# EAGLE design BASIS-LocoNet-1.1 (EAGLE 7.7.0)
LocoNet Arduino Basisboard für piggyback PCBs
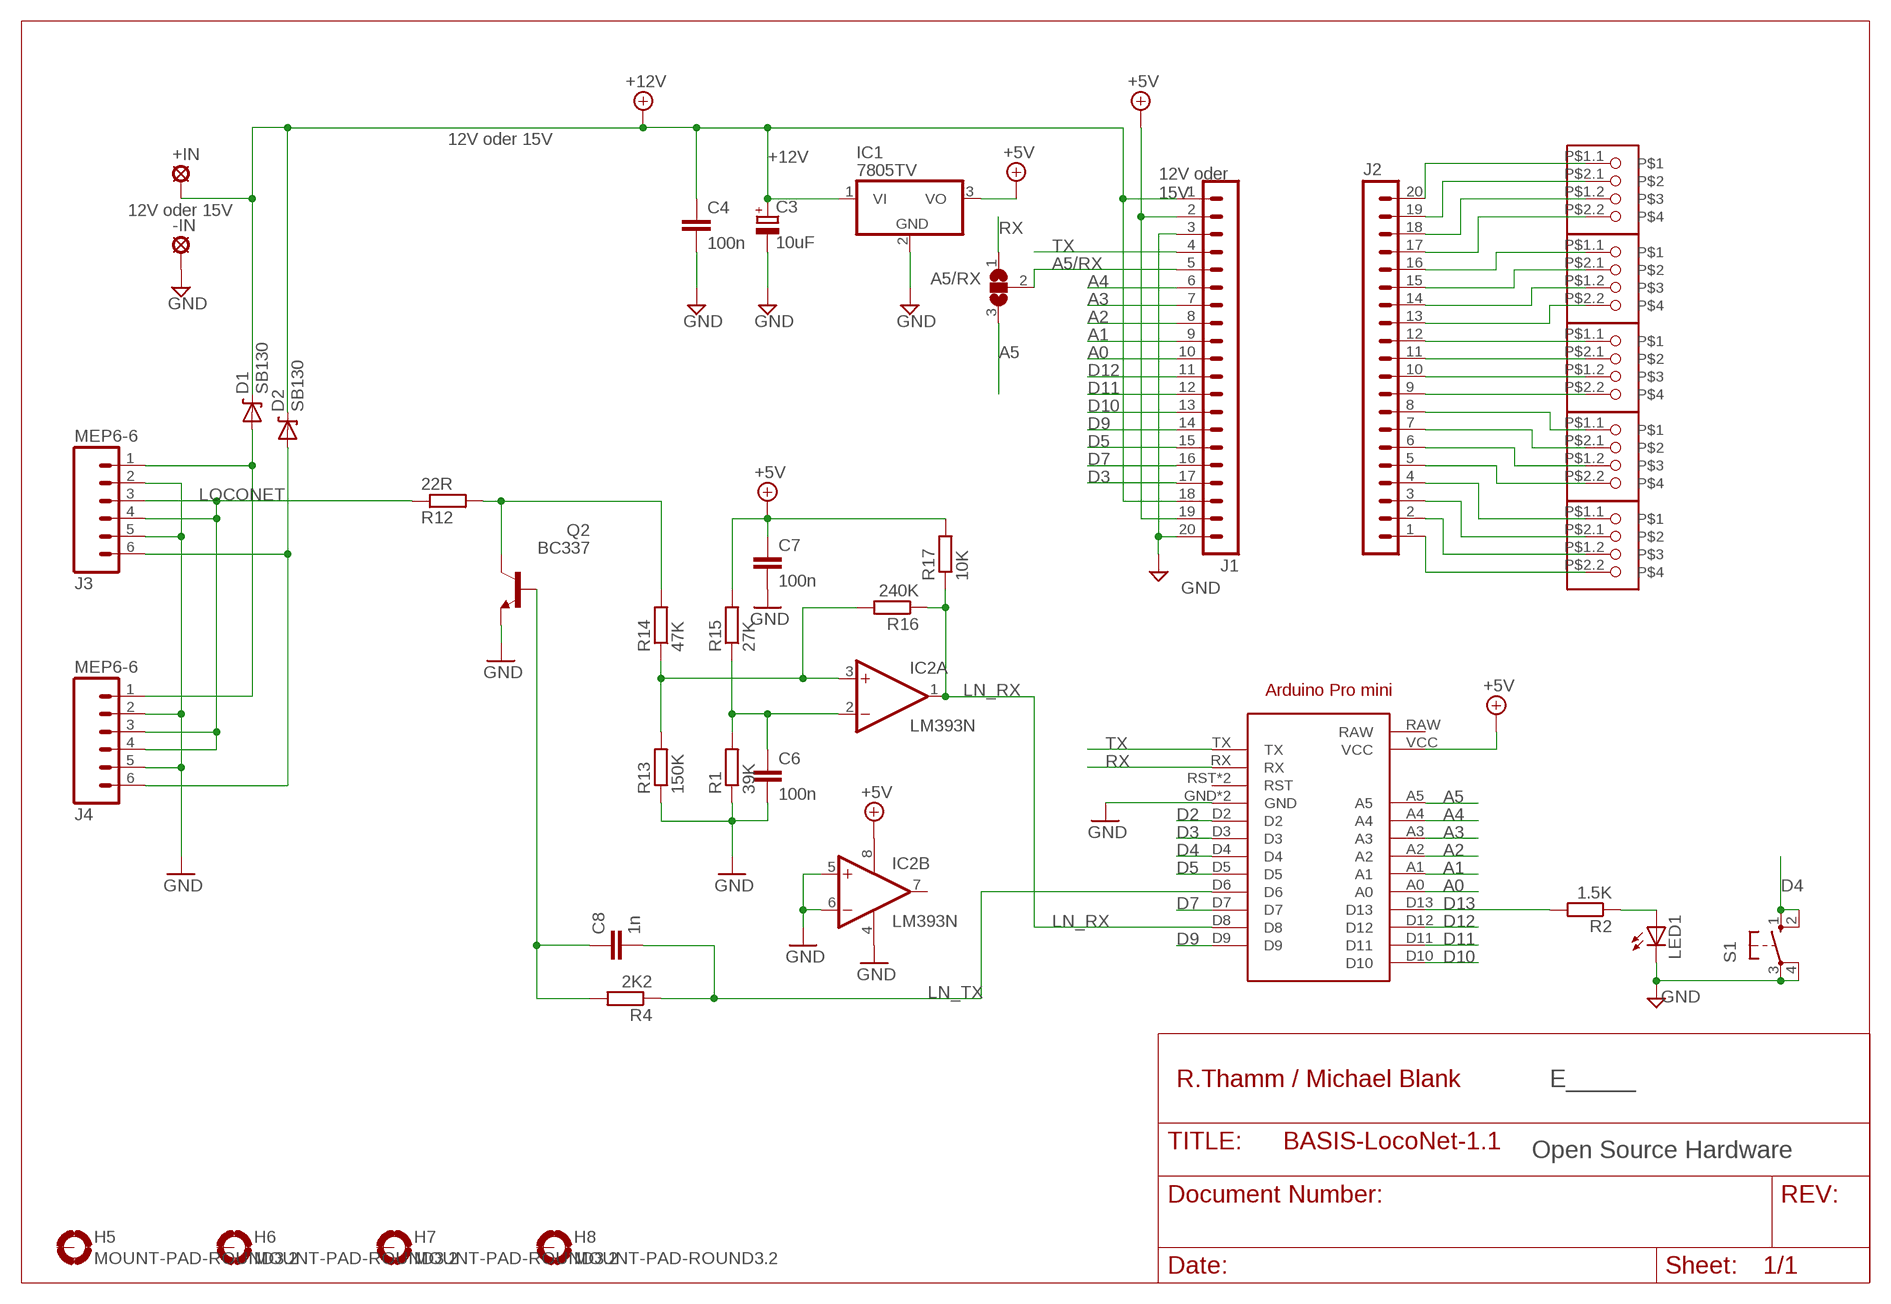
[diagram p0: schematic, sheet 1]

## Parts
+IN  LSP13  [LSP13]
-IN  LSP13  [LSP13]
A5/RX  SJ2W  [SJ_2]
ARDUINO2  ArduinoProMini_5V  ARDUINO_PRO_MINI  [ARDUINO_PRO_MINI]
C3  10uF  CPOL-EUE2.5-7  [E2,5-7]
C4  100n  C-EU050-025X075  [C050-025X075]
C6  100n  C-EU025-025X050  [C025-025X050]
C7  100n  C-EU025-025X050  [C025-025X050]
C8  1n  C-EU025-025X050  [C025-025X050]
D1  SB130  DIODE-ZENERPTH  [DIODE-ZENER]
D2  SB130  DIODE-ZENERPTH  [DIODE-ZENER]
H5  MOUNT-PAD-ROUND3.2  [3,2-PAD]
H6  MOUNT-PAD-ROUND3.2  [3,2-PAD]
H7  MOUNT-PAD-ROUND3.2  [3,2-PAD]
H8  MOUNT-PAD-ROUND3.2  [3,2-PAD]
IC1  7805TV  [TO220V]
IC2  LM393N  [DIL08]
J1  MA20-1  [MA20-1]
J2  MA20-1  [MA20-1]
J3  MEP6-6  RJ11-6PTH  [RJ11-6]
J4  MEP6-6  RJ11-6PTH  [RJ11-6]
LED1  LED3MM  [LED3MM]
Q2  BC337  [TO92]
R1  39K  R-EU_0207/10  [0207/10]
R2  1.5K  R-EU_0207/10  [0207/10]
R4  2K2  R-EU_0207/10  [0207/10]
R12  22R  R-EU_0207/10  [0207/10]
R13  150K  R-EU_0207/10  [0207/10]
R14  47K  R-EU_0207/10  [0207/10]
R15  27K  R-EU_0207/10  [0207/10]
R16  240K  R-EU_0207/10  [0207/10]
R17  10K  R-EU_0207/10  [0207/10]
S1  10-XX  [B3F-10XX]
U$1  AKL093-06  [AKL093-06]
U$2  AKL093-06  [AKL093-06]
U$3  AKL093-06  [AKL093-06]
U$4  AKL093-06  [AKL093-06]
U$5  AKL093-06  [AKL093-06]

## Nets
+5V: ARDUINO2.VCC C7.1 IC1.3(VO) IC2.8(P:V+) J1.2 J1.19 R15.2 R17.2
+12V: +IN.MP C3.+ C4.1 D1.P$1(C) D2.P$1(C) IC1.1(VI) J1.1 J1.18
A0: ARDUINO2.A0 J1.10
A1: ARDUINO2.A1 J1.9
A2: ARDUINO2.A2 J1.8
A3: ARDUINO2.A3 J1.7
A4: ARDUINO2.A4 J1.6
A5: A5/RX.3 ARDUINO2.A5
A5/RX: A5/RX.2 J1.5
D2: ARDUINO2.D2
D3: ARDUINO2.D3 J1.17
D4: ARDUINO2.D4 S1.1(S) S1.2(S1)
D5: ARDUINO2.D5 J1.15
D7: ARDUINO2.D7 J1.16
D9: ARDUINO2.D9 J1.14
D10: ARDUINO2.D10 J1.13
D11: ARDUINO2.D11 J1.12
D12: ARDUINO2.D12 J1.11
D13: ARDUINO2.D13 R2.2
GND: -IN.MP ARDUINO2.GND ARDUINO2.GND@1(GND) C3.- C4.2 C6.2 C7.2 IC1.2(GND) IC2.4(P:V-) IC2.5(B:+IN) IC2.6(B:-IN) J1.3 J1.20 J3.2 J3.5 J4.2 J4.5 LED1.K(C) Q2.1(E) R1.1 R13.1 S1.3(P) S1.4(P1)
LN_RX: ARDUINO2.D8 IC2.1(A:OUT) R16.1 R17.1
LN_TX: ARDUINO2.D6 C8.2 R4.1
LOCONET: J3.3 J3.4 J4.3 J4.4 R12.1
N$1: LED1.A R2.1
N$6: J2.1 U$4.P$2.2
N$8: J2.2 U$4.P$1.2
N$9: J2.3 U$4.P$2.1
N$10: J2.4 U$4.P$1.1
N$11: J2.5 U$3.P$2.2
N$12: J2.6 U$3.P$1.2
N$13: J2.7 U$3.P$2.1
N$14: J2.8 U$3.P$1.1
N$15: J2.9 U$1.P$2.2
N$16: J2.10 U$1.P$1.2
N$17: J2.11 U$1.P$2.1
N$18: J2.12 U$1.P$1.1
N$19: J2.13 U$2.P$2.2
N$20: J2.14 U$2.P$1.2
N$21: J2.15 U$2.P$2.1
N$22: J2.16 U$2.P$1.1
N$23: J2.17 U$5.P$2.2
N$24: J2.18 U$5.P$1.2
N$25: J2.19 U$5.P$2.1
N$26: J2.20 U$5.P$1.1
N$28: D1.P$2(A) J3.1 J4.1
N$29: C6.1 IC2.2(A:-IN) R1.2 R15.1
N$30: C8.1 Q2.2(B) R4.2
N$32: IC2.3(A:+IN) R13.2 R14.1 R16.2
N$36: Q2.3(C) R12.2 R14.2
N$37: D2.P$2(A) J3.6 J4.6
RX: A5/RX.1 ARDUINO2.RX
TX: ARDUINO2.TX J1.4
Unconnected: ARDUINO2.RAW ARDUINO2.RST ARDUINO2.RST@1(RST) H5.B3,2(MOUNT) H6.B3,2(MOUNT) H7.B3,2(MOUNT) H8.B3,2(MOUNT) IC2.7(B:OUT)

## Notes on the sheet
- 12V oder 15V
- 12V oder 
  15V
- 12V oder 15V
- R.Thamm / Michael Blank | E_____
- Open Source Hardware

## Library data of the parts
+IN -IN = solpad:LSP13: SOLDER PAD drill 1.3 mm, distributor Buerklin, 12H562
A5/RX = jumper:SJ2W: SMD solder JUMPER
ARDUINO2 = lib-basisplatineSXApmV0102:ARDUINO_PRO_MINI: For creating Arduino Pro Mini shields
C3 = resistor:CPOL-EU: POLARIZED CAPACITOR, European symbol
C4 C6-C8 = rcl:C-EU: CAPACITOR, European symbol
D1 D2 = SparkFun-DiscreteSemi:DIODE-ZENER: Zener Diode Production Part - 8199 3.4V Zener Voltage
H5-H8 = holes:MOUNT-PAD-ROUND: MOUNTING PAD, round
IC1 = linear:78*: Positive VOLTAGE REGULATOR Source: http://cache.national.com/ds/LM/LM78L05.pdf http://www.fairchildsemi.com/ds/LM/LM7805.pdf
IC2 = linear:LM393: COMPARATOR
J1 J2 = con-lstb:MA20-1: PIN HEADER; OC_FARNELL: unknown; OC_NEWARK: unknown
J3 J4 = SparkFun-Connectors:RJ11-6: RJ11 Jack Simple 6 pin RJ11 jack. Commonly found on CAT3 devices and Microchip programmers. SKU: PRT-00132
LED1 = led:LED: LED OSRAM: - CHIPLED LG R971, LG N971, LY N971, LG Q971, LY Q971, LO R971, LY R971 LH N974, LH R974 LS Q976, LO Q976, LY Q976 LO Q996 - Hyper CHIPLED LW Q18S LB Q993, LB Q99A, LB R99A - SideLED LS A670, LO A670, LY A670, LG A670, LP A670 LB A673, LV A673, LT A673, LW A673 LH A674 LY A675 LS A676, LA A676, LO A676, LY A676, LW A676 LS A679, LY A679, LG A679 - Hyper Micro SIDELED® LS Y876, LA Y876, LO Y876, LY Y876 LT Y87S - SmartLED LW L88C, LW L88S LB L89C, LB L89S, LG L890 LS L89K, LO L89K, LY L89K LS L896, LA L896, LO L896, LY L896 - TOPLED LS T670, LO T670, LY T670, LG T670, LP T670 LSG T670, LSP T670, LSY T670, LOP T670, LYG T670 LG T671, LOG T671, LSG T671 LB T673, LV T673, LT T673, LW T673 LH T674 LS T676, LA T676, LO T676, LY T676, LB T676, LH T676, LSB T676, LW T676 LB T67C, LV T67C, LT T67C, LS T67K, LO T67K, LY T67K, LW E67C LS E67B, LA E67B, LO E67B, LY E67B, LB E67C, LV E67C, LT E67C LW T67C LS T679, LY T679, LG T679 LS T770, LO T770, LY T770, LG T770, LP T770 LB T773, LV T773, LT T773, LW T773 LH T774 LS E675, LA E675, LY E675, LS T675 LS T776, LA T776, LO T776, LY T776, LB T776 LHGB T686 LT T68C, LB T68C - Hyper Mini TOPLED® LB M676 - Mini TOPLED Santana® LG M470 LS M47K, LO M47K, LY M47K Source: http://www.osram.convergy.de LUXEON: - LUMILED® LXK2-PW12-R00, LXK2-PW12-S00, LXK2-PW14-U00, LXK2-PW14-V00 LXK2-PM12-R00, LXK2-PM12-S00, LXK2-PM14-U00 LXK2-PE12-Q00, LXK2-PE12-R00, LXK2-PE12-S00, LXK2-PE14-T00, LXK2-PE14-U00 LXK2-PB12-K00, LXK2-PB12-L00, LXK2-PB12-M00, LXK2-PB14-N00, LXK2-PB14-P00, LXK2-PB14-Q00 LXK2-PR12-L00, LXK2-PR12-M00, LXK2-PR14-Q00, LXK2-PR14-R00 LXK2-PD12-Q00, LXK2-PD12-R00, LXK2-PD12-S00 LXK2-PH12-R00, LXK2-PH12-S00 LXK2-PL12-P00, LXK2-PL12-Q00, LXK2-PL12-R00 Source: www.luxeon.com KINGBRIGHT: KA-3528ASYC Source: www.kingbright.com
Q2 = transistor-npn:BC337*: NPN Transistor
R1 R2 R4 R12-R17 = rcl:R-EU_: RESISTOR, European symbol
S1 = switch-omron:10-XX: OMRON SWITCH; MPN: B3F-1000; OC_FARNELL: 176432; OC_NEWARK: 36M3542
U$1-U$5 = akl093-06-mod:AKL093-06

## Board
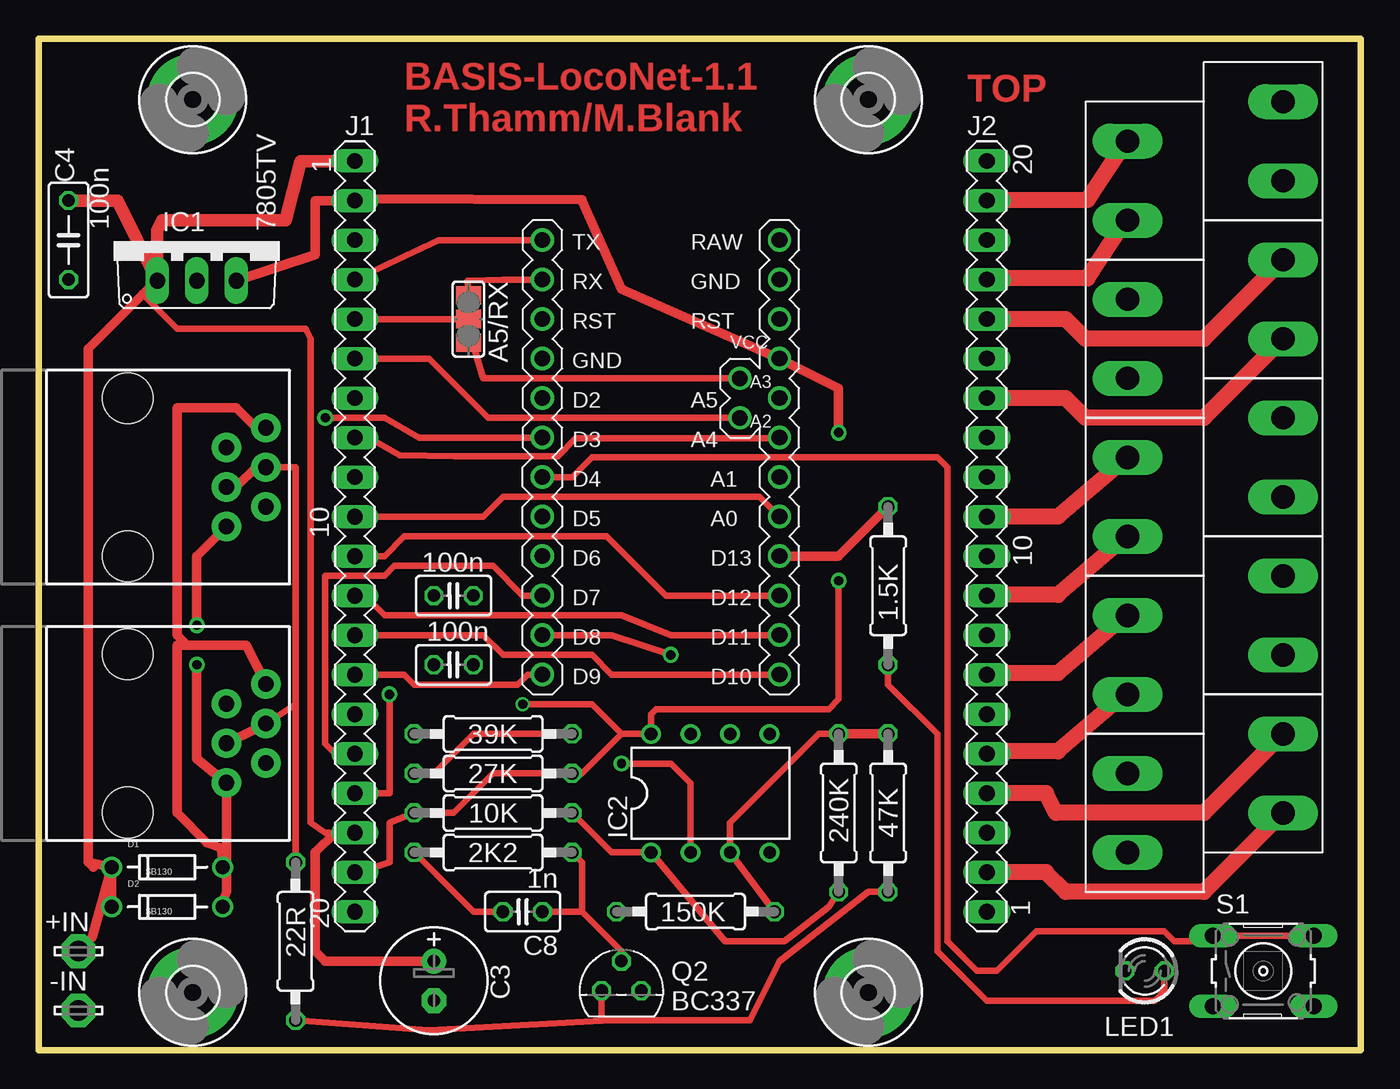
[diagram p1: board, top side]
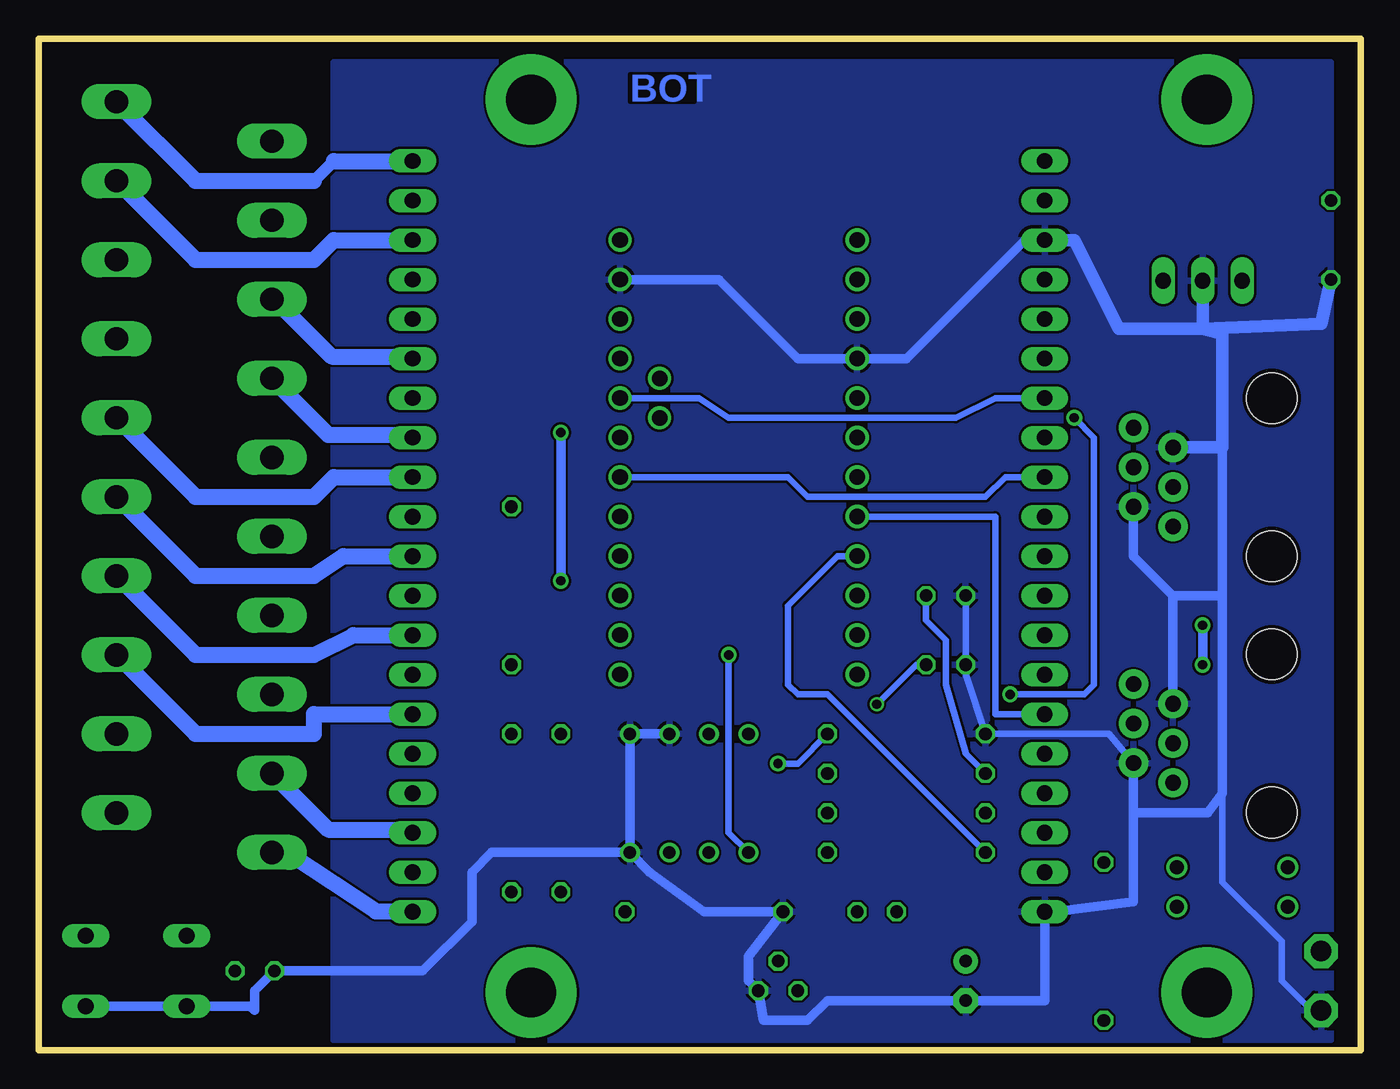
[diagram p2: board, bottom side, seen from below]

Size 85 x 65 mm. Coordinates in mm from the lower left corner, seen from the top.
Outline: 0,0 85,0 85,65 0,65 0,0
Copper layers (1*16): Top 0.018mm / dielectric 1.55mm / Bottom 0.018mm
Design rules "eC_2Layer_PClass6_BaseCopperO18_eCDefault": minimum track width 0.15mm, minimum drill 0.35mm, track to track 0.15mm, track to pad 0.15mm, pad to pad 0.15mm, via to via 0.15mm, smd to smd 0mil, copper to edge 0.25mm, drill to drill 0.35mm, minimum pad ring 0.175mm, minimum via ring 0.125mm, stop-mask expansion 0mil, vias tented up to drill 0.45mm, thermal gap 0.2mm

### Footprints (pad centres in the part's own frame; a part is rotated, then mirrored left to right if it is on the bottom)
LSP13 = drill 1.321 pad 2.159 octagon: MP 0,0
SJ_2 = smd 1.168 x 1.6: 1 -1.524,0; 2 0,0; 3 1.524,0
ARDUINO_PRO_MINI = drill 1: A0 11.43,-8.89; A1 11.43,-6.35; A2 11.43,-3.81; A3 11.43,-1.27; A4 8.89,-2.54; A5 8.89,0; D2 -3.81,-1.27; D3 -3.81,-3.81; D4 -3.81,-6.35; D5 -3.81,-8.89; D6 -3.81,-11.43; D7 -3.81,-13.97; D8 -3.81,-16.51; D9 -3.81,-19.05; D10 11.43,-19.05; D11 11.43,-16.51; D12 11.43,-13.97; D13 11.43,-11.43; GND -3.81,1.27; GND@1 11.43,6.35; RAW 11.43,8.89; RST 11.43,3.81; RST@1 -3.81,3.81; RX -3.81,6.35; TX -3.81,8.89; VCC 11.43,1.27
E2,5-7 = drill 0.813 pad 1.6: + -1.27,0 | drill 0.813 pad 1.6 octagon: - 1.27,0
C050-025X075 = drill 0.813 octagon: 1 -2.54,0; 2 2.54,0
C025-025X050 = drill 0.813 octagon: 1 -1.27,0; 2 1.27,0
DIODE-ZENER = drill 0.9: P$1 -3.556,0; P$2 3.556,0
3,2-PAD = drill 3.2 pad 5.842: B3,2 0,0
TO220V = drill 1.016 long: 1 -2.54,-2.54; 2 0,-2.54; 3 2.54,-2.54
DIL08 = drill 0.813 pad 1.27: 1 -3.81,-3.81; 2 -1.27,-3.81; 3 1.27,-3.81; 4 3.81,-3.81; 5 3.81,3.81; 6 1.27,3.81; 7 -1.27,3.81; 8 -3.81,3.81
MA20-1 = drill 1.016 long: 1 -24.13,0; 2 -21.59,0; 3 -19.05,0; 4 -16.51,0; 5 -13.97,0; 6 -11.43,0; 7 -8.89,0; 8 -6.35,0; 9 -3.81,0; 10 -1.27,0; 11 1.27,0; 12 3.81,0; 13 6.35,0; 14 8.89,0; 15 11.43,0; 16 13.97,0; 17 16.51,0; 18 19.05,0; 19 21.59,0; 20 24.13,0
RJ11-6 = drill 1.016 pad 1.88: 1 1.905,8.89; 2 3.175,6.35; 3 4.445,8.89; 4 5.715,6.35; 5 6.985,8.89; 6 8.255,6.35 | hole 3.251: 0,0; 10.16,0
LED3MM = drill 0.813 octagon: A -1.27,0; K 1.27,0
TO92 = drill 0.813 octagon: 1 1.27,0; 2 0,1.905; 3 -1.27,0
0207/10 = drill 0.813 octagon: 1 -5.08,0; 2 5.08,0
B3F-10XX = drill 1.016 long: 1 -3.251,2.261; 2 3.251,2.261; 3 -3.251,-2.261; 4 3.251,-2.261
AKL093-06 = drill 1.5 pad 2.184 long: P$1.1 -5.08,-6.35; P$1.2 -5.08,-1.27; P$2.1 4.92,-3.81; P$2.2 4.92,1.27

### Placement (x,y rotation side)
+IN  2.54,6.35 0 top
-IN  2.54,2.54 0 top
A5/RX  27.62,46.99 270 top
ARDUINO2  36.2,43.18 0 top
C3  25.4,4.45 270 top
C4  1.91,52.07 270 top
C6  26.67,29.21 180 top
C7  26.67,24.77 180 top
C8  31.11,8.89 180 top
D1  8.26,11.75 0 top
D2  8.26,9.2 0 top
H5  9.9,61.1 0 top
H6  53.34,61.1 0 top
H7  9.9,3.7 0 top
H8  53.34,3.7 0 top
IC1  10.16,52 0 top
IC2  43.18,16.51 0 top
J1  20.32,33.02 270 top
J2  60.96,33.02 90 top
J3  5.71,41.91 270 top
J4  5.71,25.43 270 top
LED1  71.12,5.08 180 top
Q2  37.47,3.81 0 top
R1  29.21,20.32 0 top
R2  54.61,29.84 90 top
R4  29.21,12.7 0 top
R12  16.51,6.99 270 top
R13  42.23,8.89 0 top
R14  54.61,15.24 270 top
R15  29.21,17.78 0 top
R16  51.44,15.24 90 top
R17  29.21,15.24 180 top
S1  78.74,5.08 0 top
U$1  74.93,34.29 180 top
U$2  74.93,44.45 180 top
U$3  74.93,24.13 180 top
U$4  74.93,13.97 180 top
U$5  74.93,54.61 180 top

### Tracks (layer width: path | path; a pad name or v marks a point on that pad's centre or on a via)
+5V  (via drill 0.6, 0.6 pad 1.02)
  Top 0.406: 37.47,20.32 34.92,17.78 R15.2 29.21,17.78 26.67,15.24 R17.2 22.54,14.61 22.54,12.06 20.64,11.43 J1.19 | v31.11,22.23 35.56,22.23 37.47,20.32 | 37.47,20.32 IC2.8 39.37,21.59 39.69,21.91 50.8,21.91 51.44,22.54 v51.44,30.16
  Top 0.61: IC1.3 17.78,51.12 17.78,54.61 J1.2 20.34,54.72 21.08,54.72 34.8,54.66 34.92,54.66 34.92,54.61 37.47,48.9 ARDUINO2.VCC 51.44,42.55 v51.44,39.69
  Bottom 0.406: C7.1 28.57,24.77 v31.11,22.23
  Bottom 0.61: v51.44,30.16 v51.44,39.69
+12V
  Top 0.406: J1.18 18.41,13.97 17.46,14.61 17.46,45.72 17.14,46.35 8.89,46.35 6.67,48.58
  Top 0.61: IC1.1 7.62,49.53 6.67,48.58 3.17,45.09 3.17,12.06 | 3.49,11.75 3.17,12.06 | 3.17,12.06 D1.P$1 | D1.P$1 D2.P$1 | D1.P$1 3.43,7.24 +IN.MP | C3.+ 18.41,5.71 17.78,6.35 17.78,12.7 19.05,13.97 J1.18
  Top 0.813: C4.1 5.08,54.61 IC1.1 7.62,52.7 7.94,53.34 15.88,53.34 16.83,57.15 J1.1
A0
  Top 0.406: J1.10 28.57,34.29 29.84,35.56 46.35,35.56 ARDUINO2.A0
A1
  Bottom 0.406: ARDUINO2.A1 36.83,36.83 35.56,35.56 24.13,35.56 22.86,36.83 J1.9
A2
  Top 0.152: ARDUINO2.A2 47.75,39.37 47.75,39.32
  Top 0.254: ARDUINO2.A2 47.62,39.32 47.75,39.32 48.23,39.32
  Top 0.406: 47.62,39.32 34.52,39.32 33.38,38.18 26.75,38.18 23.19,38.24 20.94,39.51 20.34,39.55 J1.8
A3
  Bottom 0.406: J1.7 23.5,41.91 26.04,40.64 40.64,40.64 42.55,41.91 ARDUINO2.A3
A4
  Top 0.406: J1.6 25.08,44.45 28.89,40.64 ARDUINO2.A4
A5
  Top 0.406: A5/RX.3 27.88,45.47 28.57,43.18 ARDUINO2.A5
A5/RX
  Top 0.406: A5/RX.2 J1.5
D3  (via drill 0.6 pad 1.02)
  Top 0.406: ARDUINO2.D3 24.45,39.37 22.23,40.64 v18.41,40.64 | v22.54,22.86 22.54,16.51 J1.17
  Bottom 0.406: v18.41,40.64 17.14,39.37 17.14,23.5 17.78,22.86 v22.54,22.86
D4
  Top 0.406: S1.1 S1.2 | S1.2 82.19,7.34 82.55,6.99 82.35,6.99 S1.2 | S1.2 75.92,7.34 75.56,6.99 73.03,6.99 72.39,7.62 64.14,7.62 61.59,5.08 60.33,5.08 58.42,6.99 58.42,37.47 57.78,38.1 35.56,38.1 34.29,36.83 ARDUINO2.D4
D5
  Bottom 0.406: ARDUINO2.D5 23.5,34.29 23.5,21.59 J1.15
D7
  Top 0.406: ARDUINO2.D7 31.11,29.21 29.21,31.11 22.86,31.11 22.23,30.48 18.41,30.48 18.41,19.68 19.05,19.05 J1.16
D9
  Top 0.406: J1.14 23.5,24.13 24.13,23.5 30.8,23.5 31.43,24.13 ARDUINO2.D9
D10
  Top 0.406: ARDUINO2.D10 36.83,24.13 35.56,25.4 29.84,25.4 28.57,26.67 J1.13
D11
  Top 0.406: ARDUINO2.D11 40.64,26.67 37.47,27.94 22.23,27.94 20.95,29.21 J1.12
D12
  Top 0.406: ARDUINO2.D12 40.32,29.21 36.51,33.02 23.5,33.02 22.23,31.75 J1.11
D13
  Top 0.61: ARDUINO2.D13 51.44,31.75 R2.2
GND
  Bottom 0.406: C6.2 C7.2 25.4,24.13 R1.1 16.19,20.32 J4.5 | -IN.MP 3.17,2.54 5.08,4.45 5.08,6.99 8.89,10.79 8.89,16.51
  Bottom 0.61: J1.3 21.59,52.07 29.21,44.45 ARDUINO2.GND 36.2,44.45 41.27,49.53 ARDUINO2.GND@1 | 12.06,29.21 J4.2 | J4.5 14.61,15.24 | 14.61,15.24 9.84,15.24 8.89,16.51 8.89,29.21 | 8.89,29.21 8.89,38.73 | J3.5 14.61,31.75 12.06,29.21 | 12.06,29.21 8.89,29.21 | 14.61,15.24 14.61,9.53 19.68,8.89 J1.20 20.32,3.17 C3.- 34.29,3.17 35.56,1.91 38.42,1.91 Q2.1 39.37,4.45 39.37,6.03 R13.1 42.23,8.89 45.72,11.43 IC2.4 | IC2.4 IC2.5 IC2.6 | IC2.4 55.88,12.7 57.15,11.43 57.15,8.26 60.33,5.08 LED1.K 71.12,3.81 71.12,2.54 71.4,2.82 S1.3 S1.4
  Bottom 0.813: J1.3 18.41,52.07 15.56,46.35 10.16,46.35 | 10.16,46.35 2.54,46.67 C4.2 | IC1.2 10.16,46.35 | 10.16,46.35 8.89,46.04 8.89,38.73 J3.2
  pour Bottom: 1.91,63.5 66.04,63.5 66.04,0.64 1.91,0.64
LN_RX  (via drill 0.6 pad 1.02)
  Top 0.406: R16.1 50.8,9.21 47.94,6.99 44.13,6.99 IC2.1 36.83,12.7 R17.1 | ARDUINO2.D8 36.83,26.67 v40.64,25.4
  Bottom 0.406: v40.64,25.4 40.64,13.97 IC2.1
LN_TX
  Top 0.406: C8.2 27.94,8.89 R4.1
  Bottom 0.406: ARDUINO2.D6 33.66,31.75 36.83,28.57 36.83,23.5 36.2,22.86 34.29,22.86 R4.1
LOCONET
  Top 0.406: R12.1 16.51,22.23 | J4.3 16.51,22.23 | 16.51,22.23 16.51,37.47 J3.3
  Top 0.61: J3.3 13.97,37.47 12.7,36.2 J3.4 | J4.3 13.97,20.64 J4.4
N$1
  Top 0.406: R2.1 54.61,23.5 57.78,20.32 57.78,6.35 60.96,3.17 71.75,3.17 72.39,3.81 LED1.A
N$6
  Bottom 0.254: 61.04,8.91 J2.1 | 69.83,12.57 U$4.P$2.2
  Bottom 1.016: 61.04,8.91 63.32,8.91 68.89,12.57 69.83,12.57
N$8
  Top 1.016: U$4.P$1.2 74.93,10.16 66.04,10.16 64.77,11.43 J2.2
N$9
  Bottom 0.254: 61.04,14.17 J2.3 | 69.83,17.6 U$4.P$2.1
  Bottom 1.016: 61.04,14.17 66.4,14.17 69.83,17.6
N$10
  Top 1.016: U$4.P$1.1 74.93,15.24 65.41,15.24 64.77,16.51 J2.4
N$11
  Top 0.254: 61.04,19.2 J2.5 | 69.83,22.86 U$3.P$2.2
  Top 1.016: 61.04,19.2 65.53,19.2 69.83,22.86
N$12
  Bottom 1.016: U$3.P$1.2 74.93,20.32 67.31,20.32 67.31,21.59 J2.6
N$13
  Top 0.254: 61.04,24.23 J2.7 | 69.83,27.89 U$3.P$2.1
  Top 1.016: 61.04,24.23 65.53,24.23 69.83,27.89
N$14
  Bottom 1.016: U$3.P$1.1 74.93,25.4 67.31,25.4 64.77,26.67 J2.8
N$15
  Top 0.254: 61.04,29.26 J2.9 | 69.83,32.92 U$1.P$2.2
  Top 1.016: 61.04,29.26 65.53,29.26 69.83,32.92
N$16
  Bottom 1.016: U$1.P$1.2 74.93,30.48 67.31,30.48 65.41,31.75 J2.10
N$17
  Top 0.254: 69.83,37.95 U$1.P$2.1
  Top 1.016: J2.11 65.53,34.29 69.83,37.95
N$18
  Bottom 1.016: U$1.P$1.1 74.93,35.56 67.31,35.56 66.04,36.83 J2.12
N$19
  Bottom 0.254: 61.04,39.55 J2.13 | 69.83,42.98 U$2.P$2.2
  Bottom 1.016: 61.04,39.55 66.4,39.55 69.83,42.98
N$20
  Top 1.016: U$2.P$1.2 74.93,40.64 67.31,40.64 66.04,41.91 J2.14
N$21
  Bottom 0.254: 61.04,44.58 J2.15 | 69.83,48.23 U$2.P$2.1
  Bottom 1.016: 61.04,44.58 66.17,44.58 69.83,48.23
N$22
  Top 1.016: U$2.P$1.1 74.93,45.72 67.31,45.72 66.04,46.99 J2.16
N$23
  Top 0.254: 61.04,49.61 J2.17
  Top 0.406: 69.83,53.26 U$5.P$2.2
  Top 1.016: 61.04,49.61 67.44,49.61 69.83,53.26
N$24
  Bottom 1.016: U$5.P$1.2 74.93,50.8 67.31,50.8 66.04,52.07 J2.18
N$25
  Top 0.254: 61.04,54.63 J2.19
  Top 0.406: 69.83,58.29 U$5.P$2.1
  Top 1.016: 61.04,54.63 67.44,54.63 69.83,58.29
N$26
  Bottom 0.254: 79.88,60.81 U$5.P$1.1
  Bottom 0.406: 79.88,60.81 79.86,60.81
  Bottom 0.813: 67.31,55.88 66.04,57.15
  Bottom 1.016: 79.86,60.81 74.93,55.88 67.31,55.88 | 66.04,57.15 J2.20
N$28
  Top 0.61: J3.1 13.97,40.01 12.7,41.27 8.89,41.27 8.89,26.67 9.53,26.04 | 9.53,26.04 13.34,26.04 J4.1 | 9.53,26.04 8.89,26.04 8.89,15.24 10.79,13.34 11.75,12.95 D1.P$2
N$29  (via drill 0.6 pad 1.02)
  Top 0.406: R1.2 27.94,20.32 25.4,17.78 R15.1 | IC2.2 41.91,17.14 40.64,18.41 v37.47,18.41
  Bottom 0.406: v37.47,18.41 36.2,18.41 R1.2 | C6.1 27.94,27.62 26.67,26.35 26.67,23.5 25.4,19.05 R15.1
N$30
  Top 0.406: Q2.2 37.47,6.35 34.92,8.89 | 34.92,8.89 C8.1 | 34.92,8.89 34.92,12.06 R4.2
N$32
  Top 0.406: R16.2 50.16,20.32 44.45,14.61 IC2.3 R13.2
  Top 0.61: R14.1 R16.2
N$36
  Top 0.406: R12.2 25.08,1.27 36.23,1.89 | R14.2 53.34,10.16 47.62,5.71 45.72,1.91 36.51,1.91 36.23,1.89 | Q2.3 36.2,1.93 36.23,1.89
N$37  (via drill 0.6 pad 1.02)
  Top 0.61: J4.6 12.06,17.14 | 12.06,17.14 12.06,10.16 11.81,9.53 D2.P$2 | J3.6 10.16,31.75 v10.16,27.3 | v10.16,24.77 10.16,18.73 12.06,17.14
  Bottom 0.61: v10.16,27.3 v10.16,24.77
RX
  Top 0.406: A5/RX.1 27.56,49.47 29.84,49.53 ARDUINO2.RX
TX
  Top 0.406: ARDUINO2.TX 25.72,52.07 J1.4

### Text on the board
Top: TOP | BASIS-LocoNet-1.1 / R.Thamm/M.Blank
Bottom: BOT